# EAGLE schematic wrt54_relay_board (EAGLE 6.1)
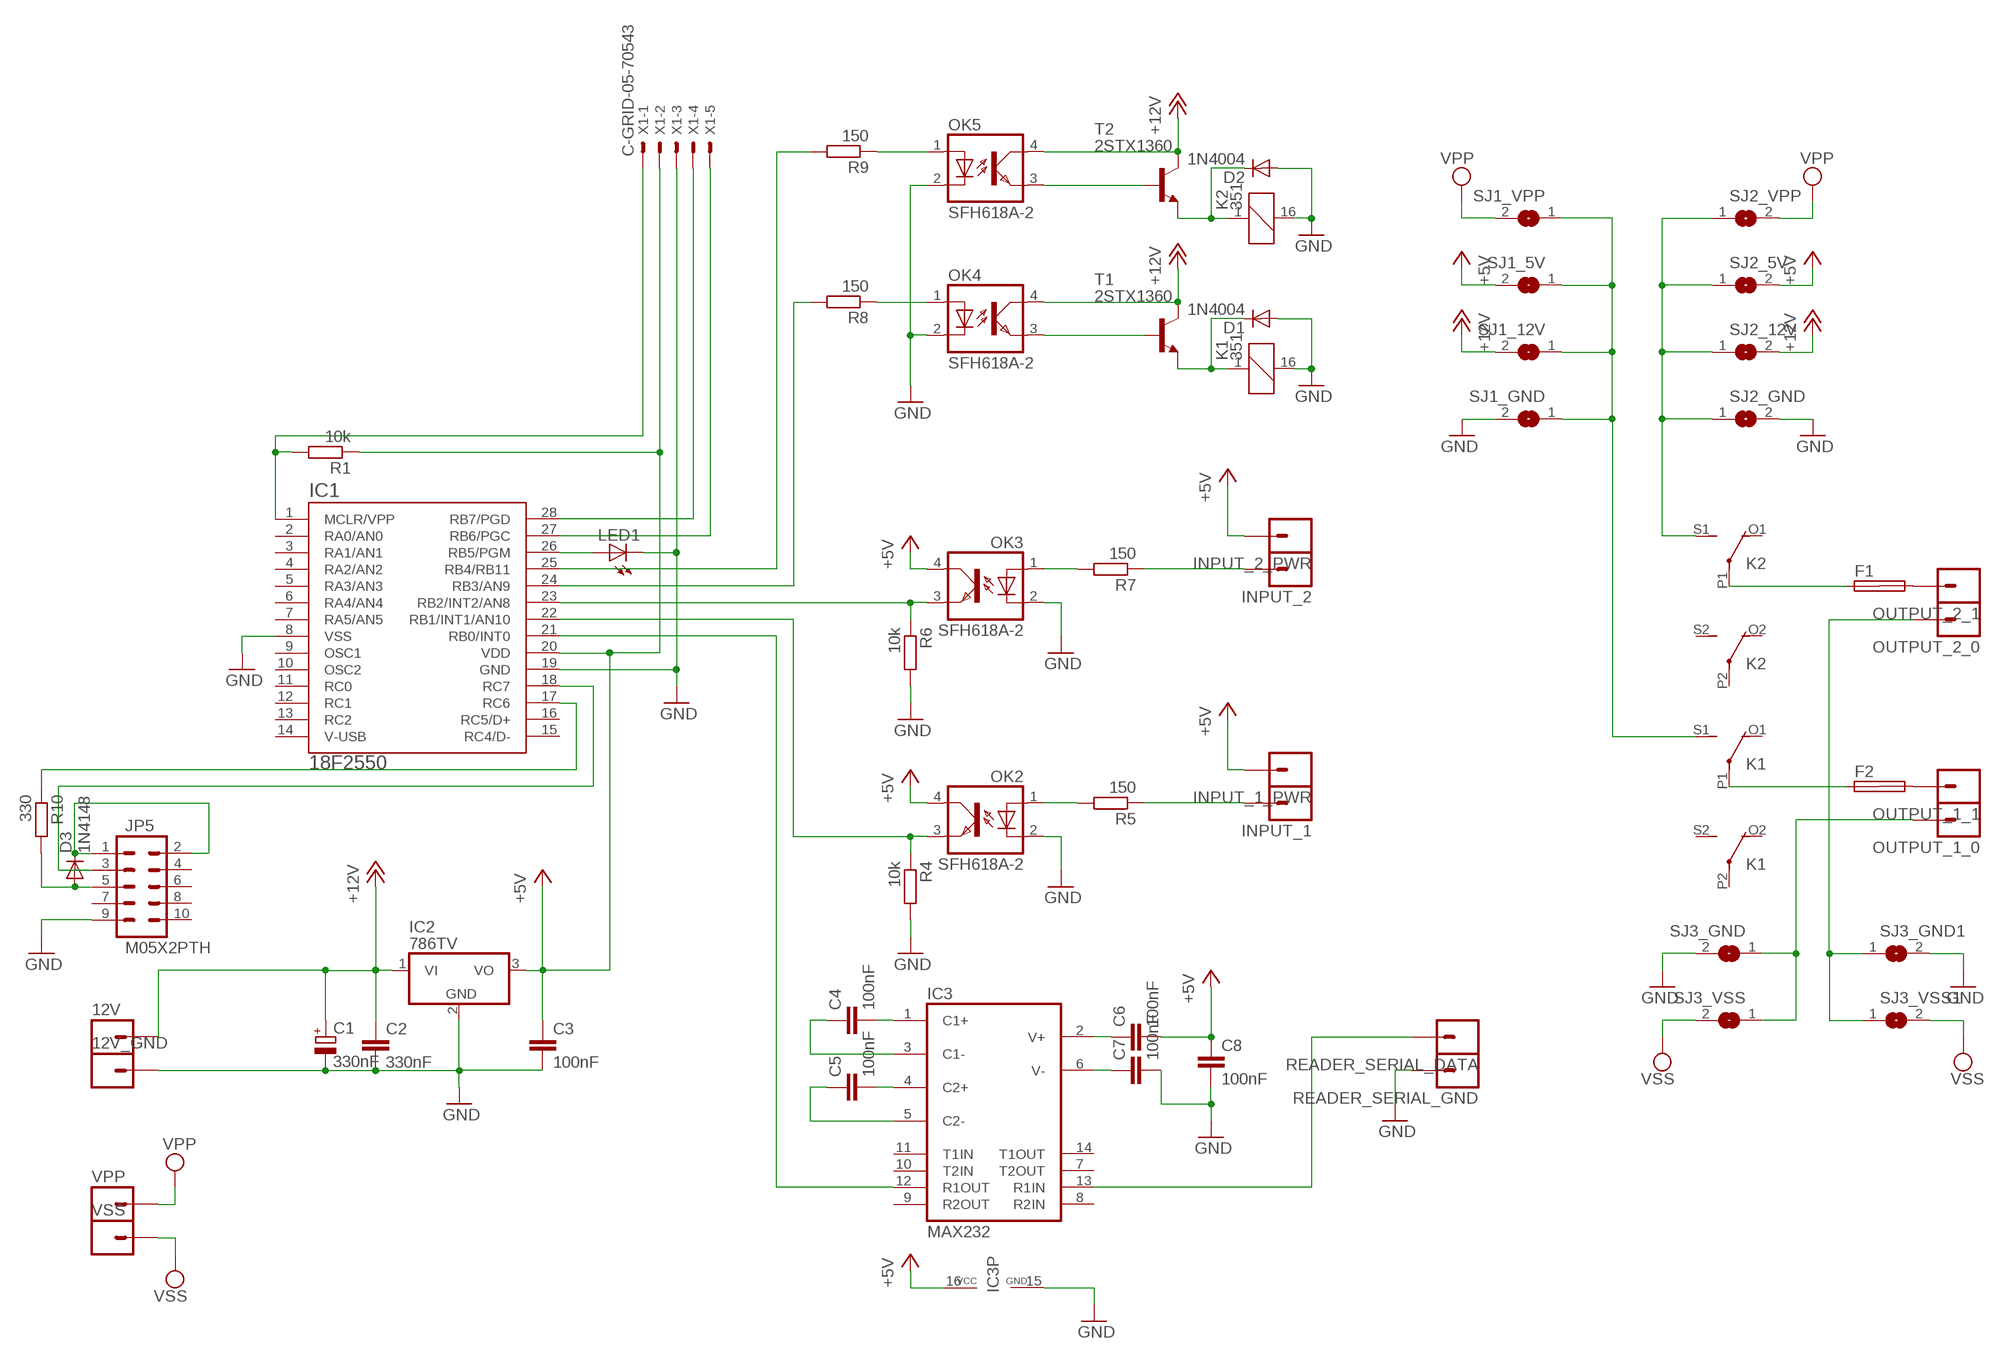
[diagram p0: schematic, sheet 1]

## Parts
12V  M01PTH_LONGPAD  [1X01_LONGPAD]
12V_GND  M01PTH_LONGPAD  [1X01_LONGPAD]
C1  330nF  CPOL-EUE5-6  [E5-6]
C2  330nF  C5/2.5  [C5B2.5]
C3  100nF  C5/2.5  [C5B2.5]
C4  100nF  C5/2.5  [C5B2.5]
C5  100nF  C5/2.5  [C5B2.5]
C6  100nF  C5/2.5  [C5B2.5]
C7  100nF  C5/2.5  [C5B2.5]
C8  100nF  C5/2.5  [C5B2.5]
D1  1N4004  1N4148DO35-7  [DO35-7]
D2  1N4004  1N4148DO35-7  [DO35-7]
D3  1N4148  1N4148DO35-7  [DO35-7]
F1  SHK20L  [SHK20L]
F2  SHK20L  [SHK20L]
IC1  18F2550  PIC18F2550DIL-28  [DIL28]
IC2  786TV  [TO220V]
IC3  MAX232  [DIL16]
INPUT_1  M01PTH_LONGPAD  [1X01_LONGPAD]
INPUT_1_PWR  M01PTH_LONGPAD  [1X01_LONGPAD]
INPUT_2  M01PTH_LONGPAD  [1X01_LONGPAD]
INPUT_2_PWR  M01PTH_LONGPAD  [1X01_LONGPAD]
JP5  M05X2PTH  [AVR_ICSP]
K1  351  [351]
K2  351  [351]
LED1  LED5MM  [LED5MM]
OK2  SFH618A-2  [DIP4]
OK3  SFH618A-2  [DIP4]
OK4  SFH618A-2  [DIP4]
OK5  SFH618A-2  [DIP4]
OUTPUT_1_0  M01PTH_LONGPAD  [1X01_LONGPAD]
OUTPUT_1_1  M01PTH_LONGPAD  [1X01_LONGPAD]
OUTPUT_2_0  M01PTH_LONGPAD  [1X01_LONGPAD]
OUTPUT_2_1  M01PTH_LONGPAD  [1X01_LONGPAD]
R1  10k  R-EU_0204/7  [0204/7]
R4  10k  R-EU_0207/10  [0207/10]
R5  150  R-EU_0204/2V  [0204V]
R6  10k  R-EU_0207/10  [0207/10]
R7  150  R-EU_0204/2V  [0204V]
R8  150  R-EU_0204/7  [0204/7]
R9  150  R-EU_0204/7  [0204/7]
R10  330  R-EU_0204/2V  [0204V]
READER_SERIAL_DATA  M01PTH_LONGPAD  [1X01_LONGPAD]
READER_SERIAL_GND  M01PTH_LONGPAD  [1X01_LONGPAD]
SJ1_5V  SJW  [SJW]
SJ1_12V  SJW  [SJW]
SJ1_GND  SJW  [SJW]
SJ1_VPP  SJW  [SJW]
SJ2_5V  SJW  [SJW]
SJ2_12V  SJW  [SJW]
SJ2_GND  SJW  [SJW]
SJ2_VPP  SJW  [SJW]
SJ3_GND  SJW  [SJW]
SJ3_GND1  SJW  [SJW]
SJ3_VSS  SJW  [SJW]
SJ3_VSS1  SJW  [SJW]
T1  2STX1360  2SC1740  [TO92-ECB]
T2  2STX1360  2SC1740  [TO92-ECB]
VPP  M01PTH_LONGPAD  [1X01_LONGPAD]
VSS  M01PTH_LONGPAD  [1X01_LONGPAD]
X1  C-GRID-05-70543  [70543-05]

## Nets
+5V: C3.1 C6.2 C8.1 IC1.20(VDD) IC2.3(VO) IC3.16(VCC) INPUT_1_PWR.1 INPUT_2_PWR.1 OK2.4(COL) OK3.4(COL) R1.1 SJ1_5V.2 SJ2_5V.2 X1.2
+12V: 12V.1 C1.+ C2.1 IC2.1(VI) OK4.4(COL) OK5.4(COL) SJ1_12V.2 SJ2_12V.2 T1.C T2.C
GND [power]: 12V_GND.1 C1.- C2.2 C3.2 C7.2 C8.2 D1.A D2.A IC1.8(VSS) IC1.19(GND) IC2.2(GND) IC3.15(GND) JP5.9 K1.16 K2.16 LED1.K(C) OK2.2(C) OK3.2(C) OK4.2(C) OK5.2(C) R4.2 R6.2 READER_SERIAL_GND.1 SJ1_GND.2 SJ2_GND.2 SJ3_GND1.2 SJ3_GND.2 X1.3
N$1: IC1.23(RB2/INT2/AN8) OK3.3(EMIT) R6.1
N$2: OK2.1(A) R5.2
N$3: INPUT_1.1 R5.1
N$4: IC1.22(RB1/INT1/AN10) OK2.3(EMIT) R4.1
N$5: INPUT_2.1 R7.1
N$6: IC1.25(RB4/RB11) R9.2
N$7: OK5.3(EMIT) T2.B
N$8: OK4.3(EMIT) T1.B
N$9: IC1.28(RB7/PGD) X1.4
N$10: IC1.1(MCLR/VPP) R1.2 X1.1
N$11: D2.C K2.1 T2.E
N$12: D1.C K1.1 T1.E
N$13: C4.2 IC3.1(C1+)
N$14: IC1.26(RB5/PGM) LED1.A
N$15: IC1.21(RB0/INT0) IC3.12(R1OUT)
N$16: IC3.13(R1IN) READER_SERIAL_DATA.1
N$17: OK3.1(A) R7.2
N$18: K2.S1(2:S) SJ2_5V.1 SJ2_12V.1 SJ2_GND.1 SJ2_VPP.1
N$19: OK5.1(A) R9.1
N$20: K1.S1(2:S) SJ1_5V.1 SJ1_12V.1 SJ1_GND.1 SJ1_VPP.1
N$21: F1.2A OUTPUT_2_1.1
N$22: F2.2A OUTPUT_1_1.1
N$23: OUTPUT_1_0.1 SJ3_GND.1 SJ3_VSS.1
N$24: IC1.17(RC6) R10.1
N$25: IC1.18(RC7) JP5.3
N$26: OUTPUT_2_0.1 SJ3_GND1.1 SJ3_VSS1.1
N$29: F1.1A K2.P1(2:P)
N$30: F2.1A K1.P1(2:P)
N$31: C5.2 IC3.4(C2+)
N$32: C4.1 IC3.3(C1-)
N$33: D3.C JP5.1 JP5.2
N$34: D3.A JP5.5 R10.2
N$35: C5.1 IC3.5(C2-)
N$36: C6.1 IC3.2(V+)
N$37: C7.1 IC3.6(V-)
N$44: IC1.24(RB3/AN9) R8.2
N$51: OK4.1(A) R8.1
N$53: IC1.27(RB6/PGC) X1.5
VPP: SJ1_VPP.2 SJ2_VPP.2 VPP.1
VSS: SJ3_VSS1.2 SJ3_VSS.2 VSS.1
Unconnected: F1.1B F1.2B F2.1B F2.2B IC1.2(RA0/AN0) IC1.3(RA1/AN1) IC1.4(RA2/AN2) IC1.5(RA3/AN3) IC1.6(RA4/AN4) IC1.7(RA5/AN5) IC1.9(OSC1) IC1.10(OSC2) IC1.11(RC0) IC1.12(RC1) IC1.13(RC2) IC1.14(V-USB) IC1.15(RC4/D-) IC1.16(RC5/D+) IC3.7(T2OUT) IC3.8(R2IN) IC3.9(R2OUT) IC3.10(T2IN) IC3.11(T1IN) IC3.14(T1OUT) JP5.4 JP5.6 JP5.7 JP5.8 JP5.10 K1.O1(2:O) K1.O2(3:O) K1.P2(3:P) K1.S2(3:S) K2.O1(2:O) K2.O2(3:O) K2.P2(3:P) K2.S2(3:S)

## Library data of the parts
12V 12V_GND INPUT_1 INPUT_1_PWR INPUT_2 INPUT_2_PWR OUTPUT_1_0 OUTPUT_1_1 OUTPUT_2_0 OUTPUT_2_1 READER_SERIAL_DATA READER_SERIAL_GND VPP VSS = SparkFun:M01: Header 1 Standard 1-pin 0.1" header. Use with straight break away headers (SKU : PRT-00116), right angle break away headers (PRT-00553), swiss pins (PRT-00743), machine pins (PRT-00117), and female headers (PRT-00115).
C1 = resistor:CPOL-EU: POLARIZED CAPACITOR, European symbol
C2-C8 = capacitor-wima:C: CAPACITOR naming: grid - package width
D1-D3 = diode:1N4148: DIODE high speed (Philips)
F1 F2 = fuse:SHK20L: FUSE HOLDER 5 x 20 mm, SH contact, SHH1 Schukat, E1073 Buerklin; OC_FARNELL: unknown; OC_NEWARK: unknown
IC1 = pic18f2550:PIC18F2550: PIC18F2550 Richard Myrick T. Arellaga April 2010
IC2 = linear:78*: Positive VOLTAGE REGULATOR Source: http://cache.national.com/ds/LM/LM78L05.pdf http://www.fairchildsemi.com/ds/LM/LM7805.pdf
IC3 = maxim:MAX232: RS232 TRANSEIVER; MF: MAXIM; MPN: MAX232ACPE+; OC_FARNELL: 9723773; OC_NEWARK: 68K4544
JP5 = SparkFun:M05X2: Header 5x2 Standard 10-pin dual row 0.1" header. Commonly used with AVR-ISP. Use with Spark Fun Electronics SKU: PRT-00778
K1 K2 = relay:351: RELAY 2 x switch, Omron; OC_FARNELL: unknown; OC_NEWARK: unknown
LED1 = led:LED: LED OSRAM: - CHIPLED LG R971, LG N971, LY N971, LG Q971, LY Q971, LO R971, LY R971 LH N974, LH R974 LS Q976, LO Q976, LY Q976 LO Q996 - Hyper CHIPLED LW Q18S LB Q993, LB Q99A, LB R99A - SideLED LS A670, LO A670, LY A670, LG A670, LP A670 LB A673, LV A673, LT A673, LW A673 LH A674 LY A675 LS A676, LA A676, LO A676, LY A676, LW A676 LS A679, LY A679, LG A679 - Hyper Micro SIDELED® LS Y876, LA Y876, LO Y876, LY Y876 LT Y87S - SmartLED LW L88C, LW L88S LB L89C, LB L89S, LG L890 LS L89K, LO L89K, LY L89K LS L896, LA L896, LO L896, LY L896 - TOPLED LS T670, LO T670, LY T670, LG T670, LP T670 LSG T670, LSP T670, LSY T670, LOP T670, LYG T670 LG T671, LOG T671, LSG T671 LB T673, LV T673, LT T673, LW T673 LH T674 LS T676, LA T676, LO T676, LY T676, LB T676, LH T676, LSB T676, LW T676 LB T67C, LV T67C, LT T67C, LS T67K, LO T67K, LY T67K, LW E67C LS E67B, LA E67B, LO E67B, LY E67B, LB E67C, LV E67C, LT E67C LW T67C LS T679, LY T679, LG T679 LS T770, LO T770, LY T770, LG T770, LP T770 LB T773, LV T773, LT T773, LW T773 LH T774 LS E675, LA E675, LY E675, LS T675 LS T776, LA T776, LO T776, LY T776, LB T776 LHGB T686 LT T68C, LB T68C - Hyper Mini TOPLED® LB M676 - Mini TOPLED Santana® LG M470 LS M47K, LO M47K, LY M47K Source: http://www.osram.convergy.de LUXEON: - LUMILED® LXK2-PW12-R00, LXK2-PW12-S00, LXK2-PW14-U00, LXK2-PW14-V00 LXK2-PM12-R00, LXK2-PM12-S00, LXK2-PM14-U00 LXK2-PE12-Q00, LXK2-PE12-R00, LXK2-PE12-S00, LXK2-PE14-T00, LXK2-PE14-U00 LXK2-PB12-K00, LXK2-PB12-L00, LXK2-PB12-M00, LXK2-PB14-N00, LXK2-PB14-P00, LXK2-PB14-Q00 LXK2-PR12-L00, LXK2-PR12-M00, LXK2-PR14-Q00, LXK2-PR14-R00 LXK2-PD12-Q00, LXK2-PD12-R00, LXK2-PD12-S00 LXK2-PH12-R00, LXK2-PH12-S00 LXK2-PL12-P00, LXK2-PL12-Q00, LXK2-PL12-R00 Source: www.luxeon.com KINGBRIGHT: KA-3528ASYC Source: www.kingbright.com
OK2-OK5 = optocoupler:SFH618?*: Optocoupler, Phototransistor Output, Low Input Current Source: http://www.vishay.com/docs/83673/sfh618.pdf
R1 R4-R10 = resistor:R-EU_: RESISTOR, European symbol
SJ1_5V SJ1_12V SJ1_GND SJ1_VPP SJ2_5V SJ2_12V SJ2_GND SJ2_VPP SJ3_GND SJ3_GND1 SJ3_VSS SJ3_VSS1 = jumper:SJ: SMD solder JUMPER
T1 T2 = transistor:2SC1740: NPN Silicon Epitaxial Planar Transistor Source: SEMTECH ELECTRONICS LTD. 2SC1740.pdf
X1 = con-molex:C-GRID-05: CONNECTOR wire to board 2.54 mm (0.100") pitch header

## Net classes
1 power: width 1.676 mm, clearance 0.508 mm